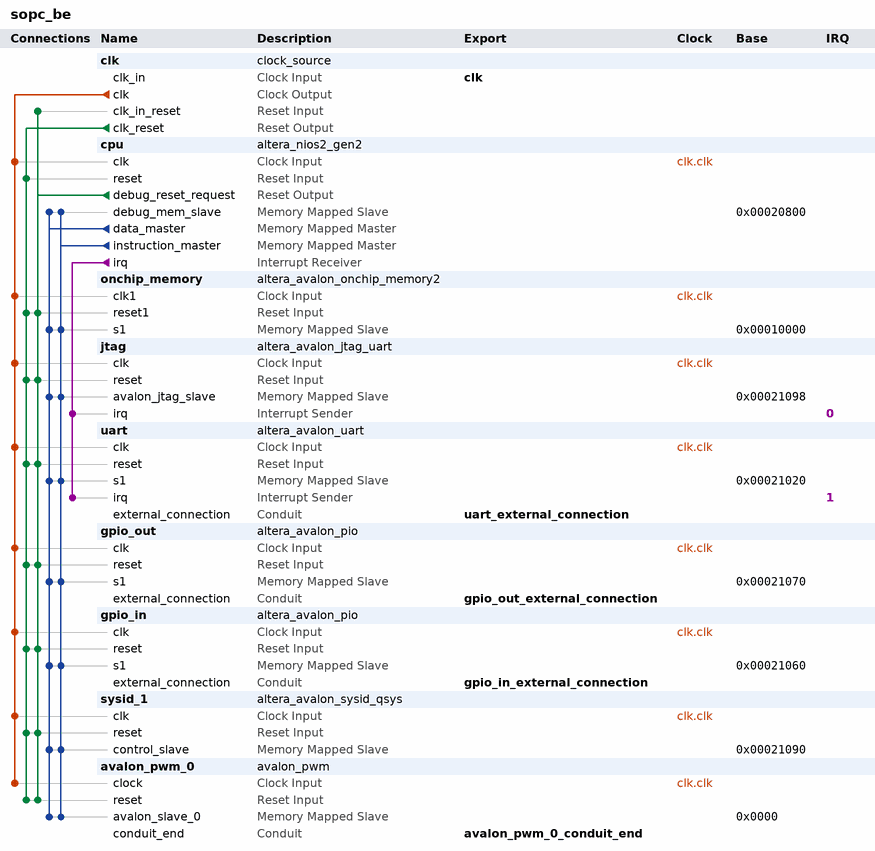
[diagram p0: system contents]
# Platform Designer (Qsys) system sopc_be, Cyclone IV E EP4CE22F17C6
# Parameters at their usual value, and those the tool derives, are not listed.
package require -exact qsys 18.1
create_system sopc_be
set_project_property DEVICE_FAMILY {Cyclone IV E}
set_project_property DEVICE EP4CE22F17C6

add_instance clk clock_source 18.1
set_instance_parameter_value clk clockFrequency 50000000

add_instance cpu altera_nios2_gen2 18.1
set_instance_parameter_value cpu dcache_size 2048
set_instance_parameter_value cpu exceptionSlave onchip_memory.s1
set_instance_parameter_value cpu icache_size 4096
set_instance_parameter_value cpu impl Tiny
set_instance_parameter_value cpu resetSlave onchip_memory.s1

add_instance onchip_memory altera_avalon_onchip_memory2 18.1
set_instance_parameter_value onchip_memory dataWidth 1024
set_instance_parameter_value onchip_memory dualPort false
set_instance_parameter_value onchip_memory initMemContent true
set_instance_parameter_value onchip_memory initializationFileName onchip_mem.hex
set_instance_parameter_value onchip_memory memorySize 40000

add_instance jtag altera_avalon_jtag_uart 18.1
set_instance_parameter_value jtag simInteractiveOptions NO_INTERACTIVE_WINDOWS

add_instance uart altera_avalon_uart 18.1
set_instance_parameter_value uart baud 115200
set_instance_parameter_value uart dataBits 8
set_instance_parameter_value uart fixedBaud true
set_instance_parameter_value uart parity NONE
set_instance_parameter_value uart stopBits 1

add_instance gpio_out altera_avalon_pio 18.1
set_instance_parameter_value gpio_out direction Output
set_instance_parameter_value gpio_out width 8

add_instance gpio_in altera_avalon_pio 18.1
set_instance_parameter_value gpio_in direction Input
set_instance_parameter_value gpio_in width 8

add_instance sysid_1 altera_avalon_sysid_qsys 18.1
set_instance_parameter_value sysid_1 id 1

add_instance avalon_pwm_0 avalon_pwm 1.0

# connections
add_connection clk.clk avalon_pwm_0.clock clock
add_connection clk.clk cpu.clk clock
add_connection clk.clk gpio_in.clk clock
add_connection clk.clk gpio_out.clk clock
add_connection clk.clk jtag.clk clock
add_connection clk.clk onchip_memory.clk1 clock
add_connection clk.clk sysid_1.clk clock
add_connection clk.clk uart.clk clock
add_connection clk.clk_reset avalon_pwm_0.reset reset
add_connection clk.clk_reset cpu.reset reset
add_connection clk.clk_reset gpio_in.reset reset
add_connection clk.clk_reset gpio_out.reset reset
add_connection clk.clk_reset jtag.reset reset
add_connection clk.clk_reset onchip_memory.reset1 reset
add_connection clk.clk_reset sysid_1.reset reset
add_connection clk.clk_reset uart.reset reset
add_connection cpu.debug_reset_request avalon_pwm_0.reset reset
add_connection cpu.debug_reset_request clk.clk_in_reset reset
add_connection cpu.debug_reset_request gpio_in.reset reset
add_connection cpu.debug_reset_request gpio_out.reset reset
add_connection cpu.debug_reset_request jtag.reset reset
add_connection cpu.debug_reset_request onchip_memory.reset1 reset
add_connection cpu.debug_reset_request sysid_1.reset reset
add_connection cpu.debug_reset_request uart.reset reset
add_connection cpu.data_master avalon_pwm_0.avalon_slave_0 avalon
set_connection_parameter_value cpu.data_master/avalon_pwm_0.avalon_slave_0 baseAddress 0x0000
add_connection cpu.data_master cpu.debug_mem_slave avalon
set_connection_parameter_value cpu.data_master/cpu.debug_mem_slave baseAddress 0x00020800
add_connection cpu.data_master gpio_in.s1 avalon
set_connection_parameter_value cpu.data_master/gpio_in.s1 baseAddress 0x00021060
add_connection cpu.data_master gpio_out.s1 avalon
set_connection_parameter_value cpu.data_master/gpio_out.s1 baseAddress 0x00021070
add_connection cpu.data_master jtag.avalon_jtag_slave avalon
set_connection_parameter_value cpu.data_master/jtag.avalon_jtag_slave baseAddress 0x00021098
add_connection cpu.data_master onchip_memory.s1 avalon
set_connection_parameter_value cpu.data_master/onchip_memory.s1 baseAddress 0x00010000
add_connection cpu.data_master sysid_1.control_slave avalon
set_connection_parameter_value cpu.data_master/sysid_1.control_slave baseAddress 0x00021090
add_connection cpu.data_master uart.s1 avalon
set_connection_parameter_value cpu.data_master/uart.s1 baseAddress 0x00021020
add_connection cpu.instruction_master avalon_pwm_0.avalon_slave_0 avalon
set_connection_parameter_value cpu.instruction_master/avalon_pwm_0.avalon_slave_0 baseAddress 0x0000
add_connection cpu.instruction_master cpu.debug_mem_slave avalon
set_connection_parameter_value cpu.instruction_master/cpu.debug_mem_slave baseAddress 0x00020800
add_connection cpu.instruction_master gpio_in.s1 avalon
set_connection_parameter_value cpu.instruction_master/gpio_in.s1 baseAddress 0x00021060
add_connection cpu.instruction_master gpio_out.s1 avalon
set_connection_parameter_value cpu.instruction_master/gpio_out.s1 baseAddress 0x00021070
add_connection cpu.instruction_master jtag.avalon_jtag_slave avalon
set_connection_parameter_value cpu.instruction_master/jtag.avalon_jtag_slave baseAddress 0x00021098
add_connection cpu.instruction_master onchip_memory.s1 avalon
set_connection_parameter_value cpu.instruction_master/onchip_memory.s1 baseAddress 0x00010000
add_connection cpu.instruction_master sysid_1.control_slave avalon
set_connection_parameter_value cpu.instruction_master/sysid_1.control_slave baseAddress 0x00021090
add_connection cpu.instruction_master uart.s1 avalon
set_connection_parameter_value cpu.instruction_master/uart.s1 baseAddress 0x00021020
add_connection cpu.irq jtag.irq interrupt
set_connection_parameter_value cpu.irq/jtag.irq irqNumber 0
add_connection cpu.irq uart.irq interrupt
set_connection_parameter_value cpu.irq/uart.irq irqNumber 1

# exported interfaces
add_interface avalon_pwm_0_conduit_end conduit end
set_interface_property avalon_pwm_0_conduit_end EXPORT_OF avalon_pwm_0.conduit_end
add_interface clk clock sink
set_interface_property clk EXPORT_OF clk.clk_in
add_interface gpio_in_external_connection conduit end
set_interface_property gpio_in_external_connection EXPORT_OF gpio_in.external_connection
add_interface gpio_out_external_connection conduit end
set_interface_property gpio_out_external_connection EXPORT_OF gpio_out.external_connection
add_interface uart_external_connection conduit end
set_interface_property uart_external_connection EXPORT_OF uart.external_connection

set_interconnect_requirement {$system} qsys_mm.clockCrossingAdapter HANDSHAKE
set_interconnect_requirement {$system} qsys_mm.enableEccProtection FALSE
set_interconnect_requirement {$system} qsys_mm.insertDefaultSlave FALSE
set_interconnect_requirement {$system} qsys_mm.maxAdditionalLatency 1

save_system sopc_be.qsys
